# Altium schematic sheet 2012_carte_alim_SCHEMA.SchDoc
size A4
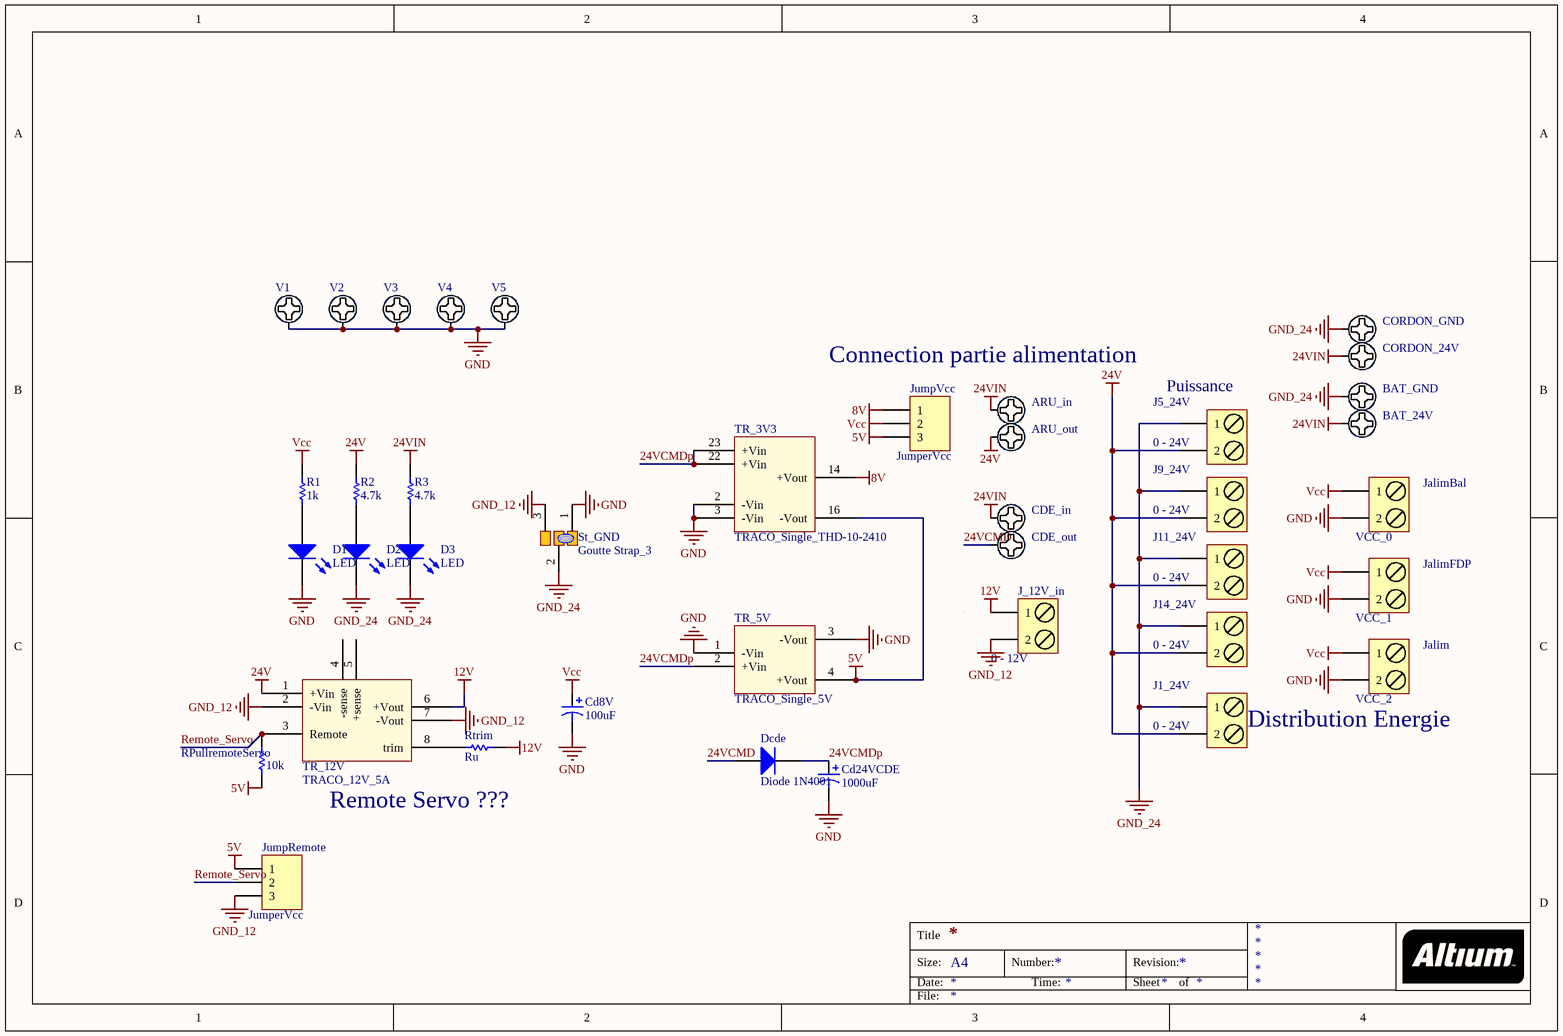
[diagram p0: 2012_carte_alim_SCHEMA.SchDoc]

## Parts
ARU_in  Pad_M3  [M3x6mm]  (value not drawn)
ARU_out  Pad_M3  [M3x6mm]  (value not drawn)
BAT_24V  Pad_M3  [M3x6mm]  (value not drawn)
BAT_GND  Pad_M3  [M3x6mm]  (value not drawn)
Cd8V  100uF  [CAPPR5-10X12.5_3D]
Cd24VCDE  1000uF  [CAPPR7.5-18X40]
CDE_in  Pad_M3  [M3x6mm]  (value not drawn)
CDE_out  Pad_M3  [M3x6mm]  (value not drawn)
CORDON_24V  Pad_M3  [M3x6mm]  (value not drawn)
CORDON_GND  Pad_M3  [M3x6mm]  (value not drawn)
D1  LED  [LED_0805]
D2  LED  [LED_0805]
D3  LED  [LED_0805]
Dcde  Diode 1N4001  [DIO10.46-5.3x2.8]
J1_24V  0 - 24V  [BORNIER2_FEM_COUDE]
J5_24V  0 - 24V  [BORNIER2_FEM_COUDE]
J9_24V  0 - 24V  [BORNIER2_FEM_COUDE]
J11_24V  0 - 24V  [BORNIER2_FEM_COUDE]
J14_24V  0 - 24V  [BORNIER2_FEM_COUDE]
J_12V_in  0 - 12V  [BORNIER2_FEM_COUDE]
Jalim  VCC_2  [Bornier_2_pas 5.08mm]
JalimBal  VCC_0  [BORNIER2]
JalimFDP  VCC_1  [BORNIER2]
JumpRemote  JumperVcc  [HE14_3]
JumpVcc  JumperVcc  [HE14_3]
R1  1k  [R1206_N]
R2  4.7k  [R1206_N]
R3  4.7k  [R1206_N]
RPullremoteServo  10k  [R1206_N]
Rtrim  Ru  [R1206_N]
St_GND  Goutte Strap_3  [Goutte Strap_3]
TR_3V3  TRACO_Single_THD-10-2410  [TRACO_Single - 3.3V 3A THD-10-2410]
TR_5V  TRACO_Single_5V  [TRACO_Single]
TR_12V  TRACO_12V_5A  [TRACO_SIMPLE_12V_5A]
V1  Pad_M3  [M3x6mm]  (value not drawn)
V2  Pad_M3  [M3x6mm]  (value not drawn)
V3  Pad_M3  [M3x6mm]  (value not drawn)
V4  Pad_M3  [M3x6mm]  (value not drawn)
V5  Pad_M3  [M3x6mm]  (value not drawn)

## Nets
5V: JumpRemote.1 JumpVcc.3 RPullremoteServo.2 TR_3V3.16(-Vout) TR_5V.4(+Vout)
8V: JumpVcc.1 TR_3V3.14(+Vout)
12V: J_12V_in.1 Rtrim.2 TR_12V.6(+Vout)
24V: ARU_out.1 J1_24V.2 J5_24V.2 J9_24V.2 J11_24V.2 J14_24V.2 R2.1 TR_12V.1(+Vin)
24VIN: ARU_in.1 BAT_24V.1 CDE_in.1 CORDON_24V.1 R3.1
GND: Cd8V.2 Cd24VCDE.2 D1.2(K) Jalim.2 JalimBal.2 JalimFDP.2 St_GND.1 TR_3V3.2(-Vin) TR_3V3.3(-Vin) TR_5V.1(-Vin) TR_5V.3(-Vout) V1.1 V2.1 V3.1 V4.1 V5.1
GND_12: J_12V_in.2 JumpRemote.3 St_GND.3 TR_12V.2(-Vin) TR_12V.7(-Vout)
GND_24: BAT_GND.1 CORDON_GND.1 D2.2(K) D3.2(K) J1_24V.1 J5_24V.1 J9_24V.1 J11_24V.1 J14_24V.1 St_GND.2
Vcc: Cd8V.1 Jalim.1 JalimBal.1 JalimFDP.1 JumpVcc.2 R1.1
24VCMD: CDE_out.1 Dcde.1(A)
24VCMDp: Cd24VCDE.1 Dcde.2(K) TR_3V3.22(+Vin) TR_3V3.23(+Vin) TR_5V.2(+Vin)
Remote_Servo: JumpRemote.2 RPullremoteServo.1 TR_12V.3(Remote)
NetD1_1: D1.1(A) R1.2
NetD2_1: D2.1(A) R2.2
NetD3_1: D3.1(A) R3.2
NetRtrim_1: Rtrim.1 TR_12V.8(trim)

Not connected (* = marked no-connect by the designer): TR_12V 4(-sense) 5(+sense)

## Notes on the sheet
- Connection partie alimentation
- (near J5_24V) Puissance
- Distribution Energie
- Remote Servo ???
- Title
- Size:
- Date:
- A4
- Number:
- Time:
- Revision:
- Sheet
- of
- File:

## Library data of the parts
ARU_in ARU_out BAT_24V BAT_GND CDE_in CDE_out CORDON_24V CORDON_GND V1-V5 = Vis M3 X 6mm _TORX_Tête 6mm: Publisher: Damien Guitton
Cd8V Cd24VCDE = Condensateur Polarise Traversant: Polarized Capacitor
D1-D3 = LED: Typical LED; Published: 8-Jun-2000; LatestRevisionDate: 08-Jul-2005; LatestRevisionNote: Mech Layer 1 removed.; PackageReference: LED-1; Publisher: Altium Limited
Dcde = Diode 1N4001: 1 Amp General Purpose Rectifier; Published: 8-Jun-2000; LatestRevisionDate: 17-Jul-2002; LatestRevisionNote: Re-released for DXP Platform.; DatasheetVersion: 1998; PackageVersion: Aug-1999; PackageReference: DO-41; Publisher: Altium Limited; Code_JEDEC: DO-204-AL; ComponentLink1Description: Manufacturer Link; ComponentLink1URL: http://www.fairchildsemi.com/; ComponentLink2Description: Datasheet; ComponentLink2URL: http://www.fairchildsemi.com/ds/1N%2F1N4001.pdf
J1_24V J5_24V J9_24V J11_24V J14_24V J_12V_in Jalim JalimBal JalimFDP = BORNIER2: Terminal blocks, 2 pins, pitch=5mm
JumpRemote JumpVcc = BARRETTE3: Header, 3-Pin; LatestRevisionDate: 17-Jul-2002; LatestRevisionNote: Re-released for DXP Platform.; Publisher: Altium Limited
R1-R3 RPullremoteServo Rtrim = Resistor: Published: 8-Jun-2000; LatestRevisionDate: 17-Jul-2002; LatestRevisionNote: Re-released for DXP Platform.; PackageReference: AXIAL-0.5; Publisher: Altium Limited
TR_5V = TRACO_Single
St_GND = Goutte Strap_3: LatestRevisionDate: 25/11/09; Publisher: Damien Guitton